# Altium schematic sheet EXTERN.SchDoc
size A
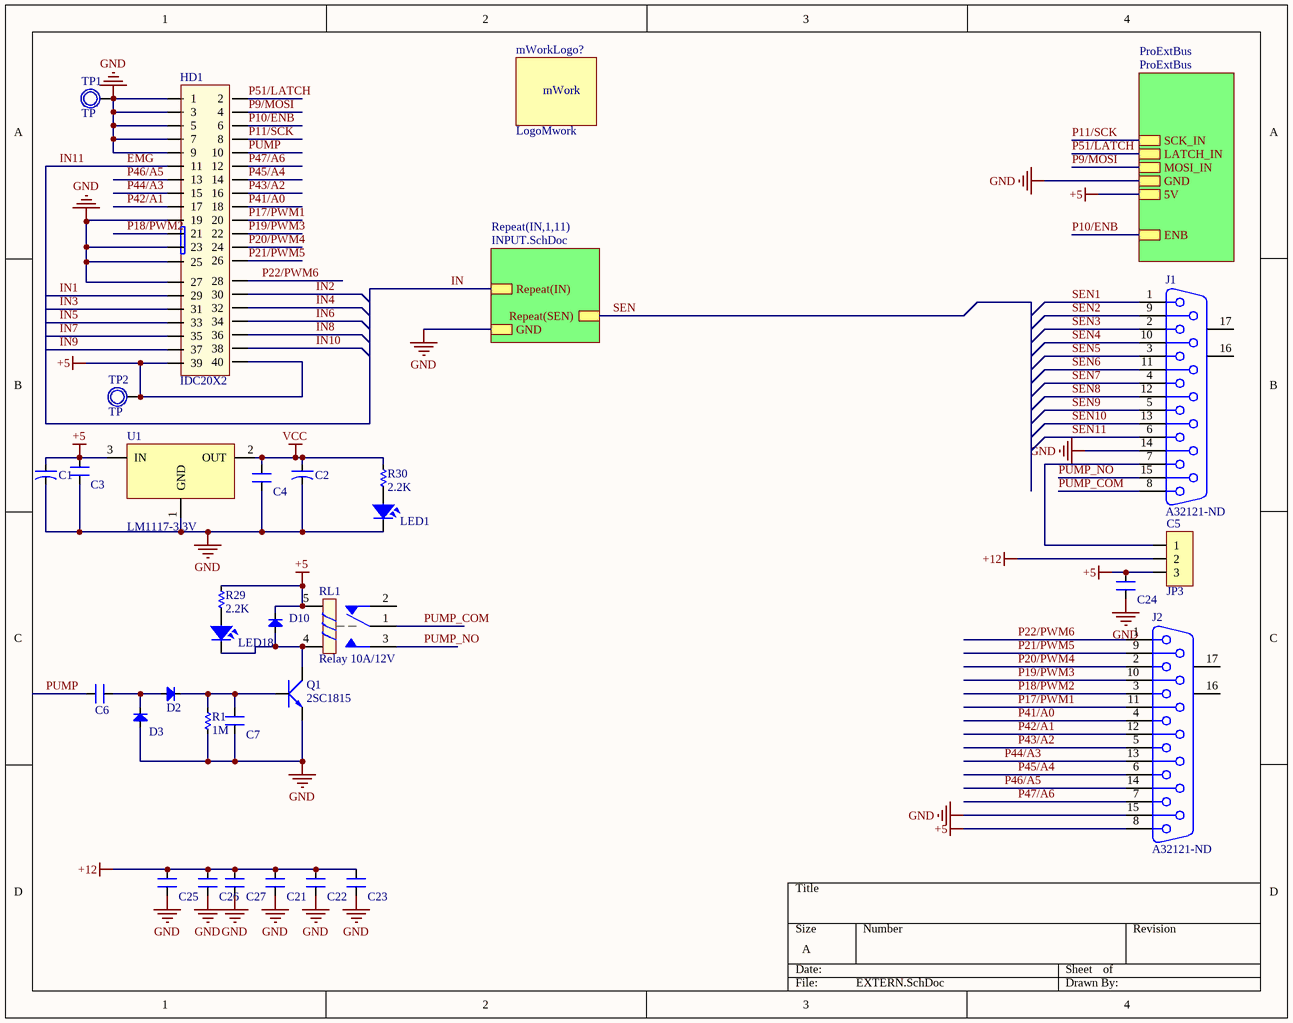
[diagram p0: EXTERN.SchDoc]

## Parts
C1  CN-ALU-SMD  [CAP-ALU-SMD-F]  (value not drawn)
C2  CN-ALU-SMD  [CAP-ALU-SMD-F]  (value not drawn)
C3  CN  [CN-SMD-0603_big]  (value not drawn)
C4  CN  [CN-SMD-0603_big]  (value not drawn)
C5  JP3  [JP3-CLOSED]
C6  10nF  [CN-SMD-0805]  (value not drawn)
C7  10nF  [CN-SMD-0805]  (value not drawn)
C21  CN  [CN-SMD-0603_big]  (value not drawn)
C22  CN  [CN-SMD-0603_big]  (value not drawn)
C23  CN  [CN-SMD-0603_big]  (value not drawn)
C24  CN  [CN-SMD-0603_big]  (value not drawn)
C25  CN  [CN-SMD-0603_big]  (value not drawn)
C26  CN  [CN-SMD-0603_big]  (value not drawn)
C27  CN  [CN-SMD-0603_big]  (value not drawn)
D2  Diode  [DIO-SMD-106-HayDung]  (value not drawn)
D3  Diode  [DIO-SMD-106-HayDung]  (value not drawn)
D10  1N4148  [DIO-SMD-106-HayDung]  (value not drawn)
HD1  IDC20X2  [IDC40]
J1  A32121-ND  [DB15]
J2  A32121-ND  [DB15]
LED1  LED  [LED-0805-Blue]  (value not drawn)
LED18  LED  [LED-0805-Blue]  (value not drawn)
mWorkLogo?  LogoMwork  [LogoMwork30*12]
Q1  2SC1815  [TO92-123]
R1  1M  [RES-SMD-0805]
R29  2.2K  [RES-SMD-0805]
R30  2.2K  [RES-SMD-0805]
RL1  Relay 10A/12V  [RELAY 5]
TP1  TP  [TP1]
TP2  TP  [TP1]
U1  LM1117-3.3V  [SOT223]

## Sub-sheets
ProExtBus = ProExtBus: SCK_IN, LATCH_IN, MOSI_IN, GND, 5V, ENB
Repeat(IN,1,11) = INPUT.SchDoc: Repeat(IN), GND, Repeat(SEN)

## Nets
+5: C1.1 C3.2 C5.3 C24.2 D10.2(K) HD1.39 HD1.40 J2.8 R29.1 RL1.5 TP2.1 U1.3(IN) ; sheet ProExtBus/5V
+12: C5.2 C21.2 C22.2 C23.2 C25.2 C26.2 C27.2
GND: C1.2 C2.2 C3.1 C4.1 C7.1 C21.1 C22.1 C23.1 C24.1 C25.1 C26.1 C27.1 D3.1(A) HD1.1 HD1.3 HD1.5 HD1.7 HD1.9 HD1.19 HD1.23 HD1.25 HD1.27 J1.14 J2.15 LED1.2 Q1.1(E) R1.2 TP1.1 U1.1(GND) ; sheet ProExtBus/GND, sheet Repeat(IN,1,11)/GND
VCC: C2.1 C4.2 R30.1 U1.2(OUT)
EMG: HD1.11  [also labelled IN11]
IN: sheet Repeat(IN,1,11)/Repeat(IN)
IN1: HD1.29
IN2: HD1.30
IN3: HD1.31
IN4: HD1.32
IN5: HD1.33
IN6: HD1.34
IN7: HD1.35
IN8: HD1.36
IN9: HD1.37
IN10: HD1.38
P9/MOSI: HD1.4 ; sheet ProExtBus/MOSI_IN
P10/ENB: HD1.6 ; sheet ProExtBus/ENB
P11/SCK: HD1.8 ; sheet ProExtBus/SCK_IN
P17/PWM1: HD1.20 J2.11
P18/PWM2: HD1.21 J2.3
P19/PWM3: HD1.22 J2.10
P20/PWM4: HD1.24 J2.2
P21/PWM5: HD1.26 J2.9
P22/PWM6: HD1.28 J2.1
P41/A0: HD1.18 J2.4
P42/A1: HD1.17 J2.12
P43/A2: HD1.16 J2.5
P44/A3: HD1.15 J2.13
P45/A4: HD1.14 J2.6
P46/A5: HD1.13 J2.14
P47/A6: HD1.12 J2.7
P51/LATCH: HD1.2 ; sheet ProExtBus/LATCH_IN
PUMP: C6.1 HD1.10
PUMP_COM: J1.8 RL1.1
PUMP_NO: J1.15 RL1.3
SEN: sheet Repeat(IN,1,11)/Repeat(SEN)
SEN1: J1.1
SEN2: J1.9
SEN3: J1.2
SEN4: J1.10
SEN5: J1.3
SEN6: J1.11
SEN7: J1.4
SEN8: J1.12
SEN9: J1.5
SEN10: J1.13
SEN11: J1.6
NetC5_1: C5.1 J1.7
NetC6_2: C6.2 D2.1(A) D3.2(K)
NetC7_2: C7.2 D2.2(K) Q1.3(B) R1.1
NetD10_1: D10.1(A) LED18.2 Q1.2(C) RL1.4
NetLED1_1: LED1.1 R30.2
NetLED18_1: LED18.1 R29.2

Not connected (* = marked no-connect by the designer): J1 16(MH1) 17(MH2); J2 16(MH1) 17(MH2); RL1 2

## Notes on the sheet
- (in symbol LogoMwork) mWork

## Library data of the parts
C1 C2 = CN-ALU-SMD: Polarized Capacitor (Axial); Published: 8-Jun-2000; LatestRevisionDate: 17-Jul-2002; LatestRevisionNote: Re-released for DXP Platform.; PackageReference: POLAR0.8; Publisher: Altium Limited
C3 C4 C6 C7 C21-C27 = CN: Value: 33pF
C5 = JP3: WR-PHD 2.54 mm Angled Socket Header; Manufacturer: W¨¹rth Elektronik eiSos GmbH; partNo: 613003143121; ComponentLink1 Description: Manufacturer; ComponentLink2 Description: Datasheet; NoPins: 03; Created Date: 29 March 2013; ComponentLink1URL: http://www.we-online.com; ComponentLink2URL: http://katalog.we-online.de/em/datasheet/6130xx143121.pdf; Created by: Karrer Zheng
D2 D3 D10 = Diode: Default Diode; Code - JEDEC: DO-214-AB; Value: 1N5007; Published: 8-Jun-2000; Revision: July-2002: Re-released for DXP Platform.; Publisher: Altium Limited; ComponentLink1Description: ES1J - STMBL; ComponentLink1URL: https://banlinhkien.vn/goods-8089-es1j-do214-diode-1a-600v-sma-es1j-.html
HD1 = IDC20X2: IDC 13x2; Value: Header 5x2
J1 J2 = DB15: Receptacle Assembly, 15 Position, Right Angle; PackageDocument: O; Positions: 15; Published: 15-Jun-2001; LatestRevisionDate: 17-Jul-2002; LatestRevisionNote: Re-released for DXP Platform.; DatasheetDocument: 1-Sep-99; PackageReference: 788757; Publisher: Altium Limited; Orientation: Right Angle; Gender: Receptacle
LED1 LED18 = LED SMD: Value: LED 3 - 5 ly 2 Colour
Q1 = 2SC1815: NPN 600mW, ECB; Value: C1815
R1 R29 R30 = R
RL1 = Relay 5: Relay SPDT,10A - 12VDC 5 Pin; Value: Relay SPDT, 10A, 12V
TP1 TP2 = TP1: Test Point; Value: Test Point
U1 = LM1117: 800mA Low-Dropout Linear Regulator; Creator: Nguyen Ba Bien; Website: http://group3i.net